# EAGLE schematic Bidirectional_Amp (EAGLE 8.6.1)

## Sheet 1 of 7: WiFi Adapter Interface and TX/RX Control
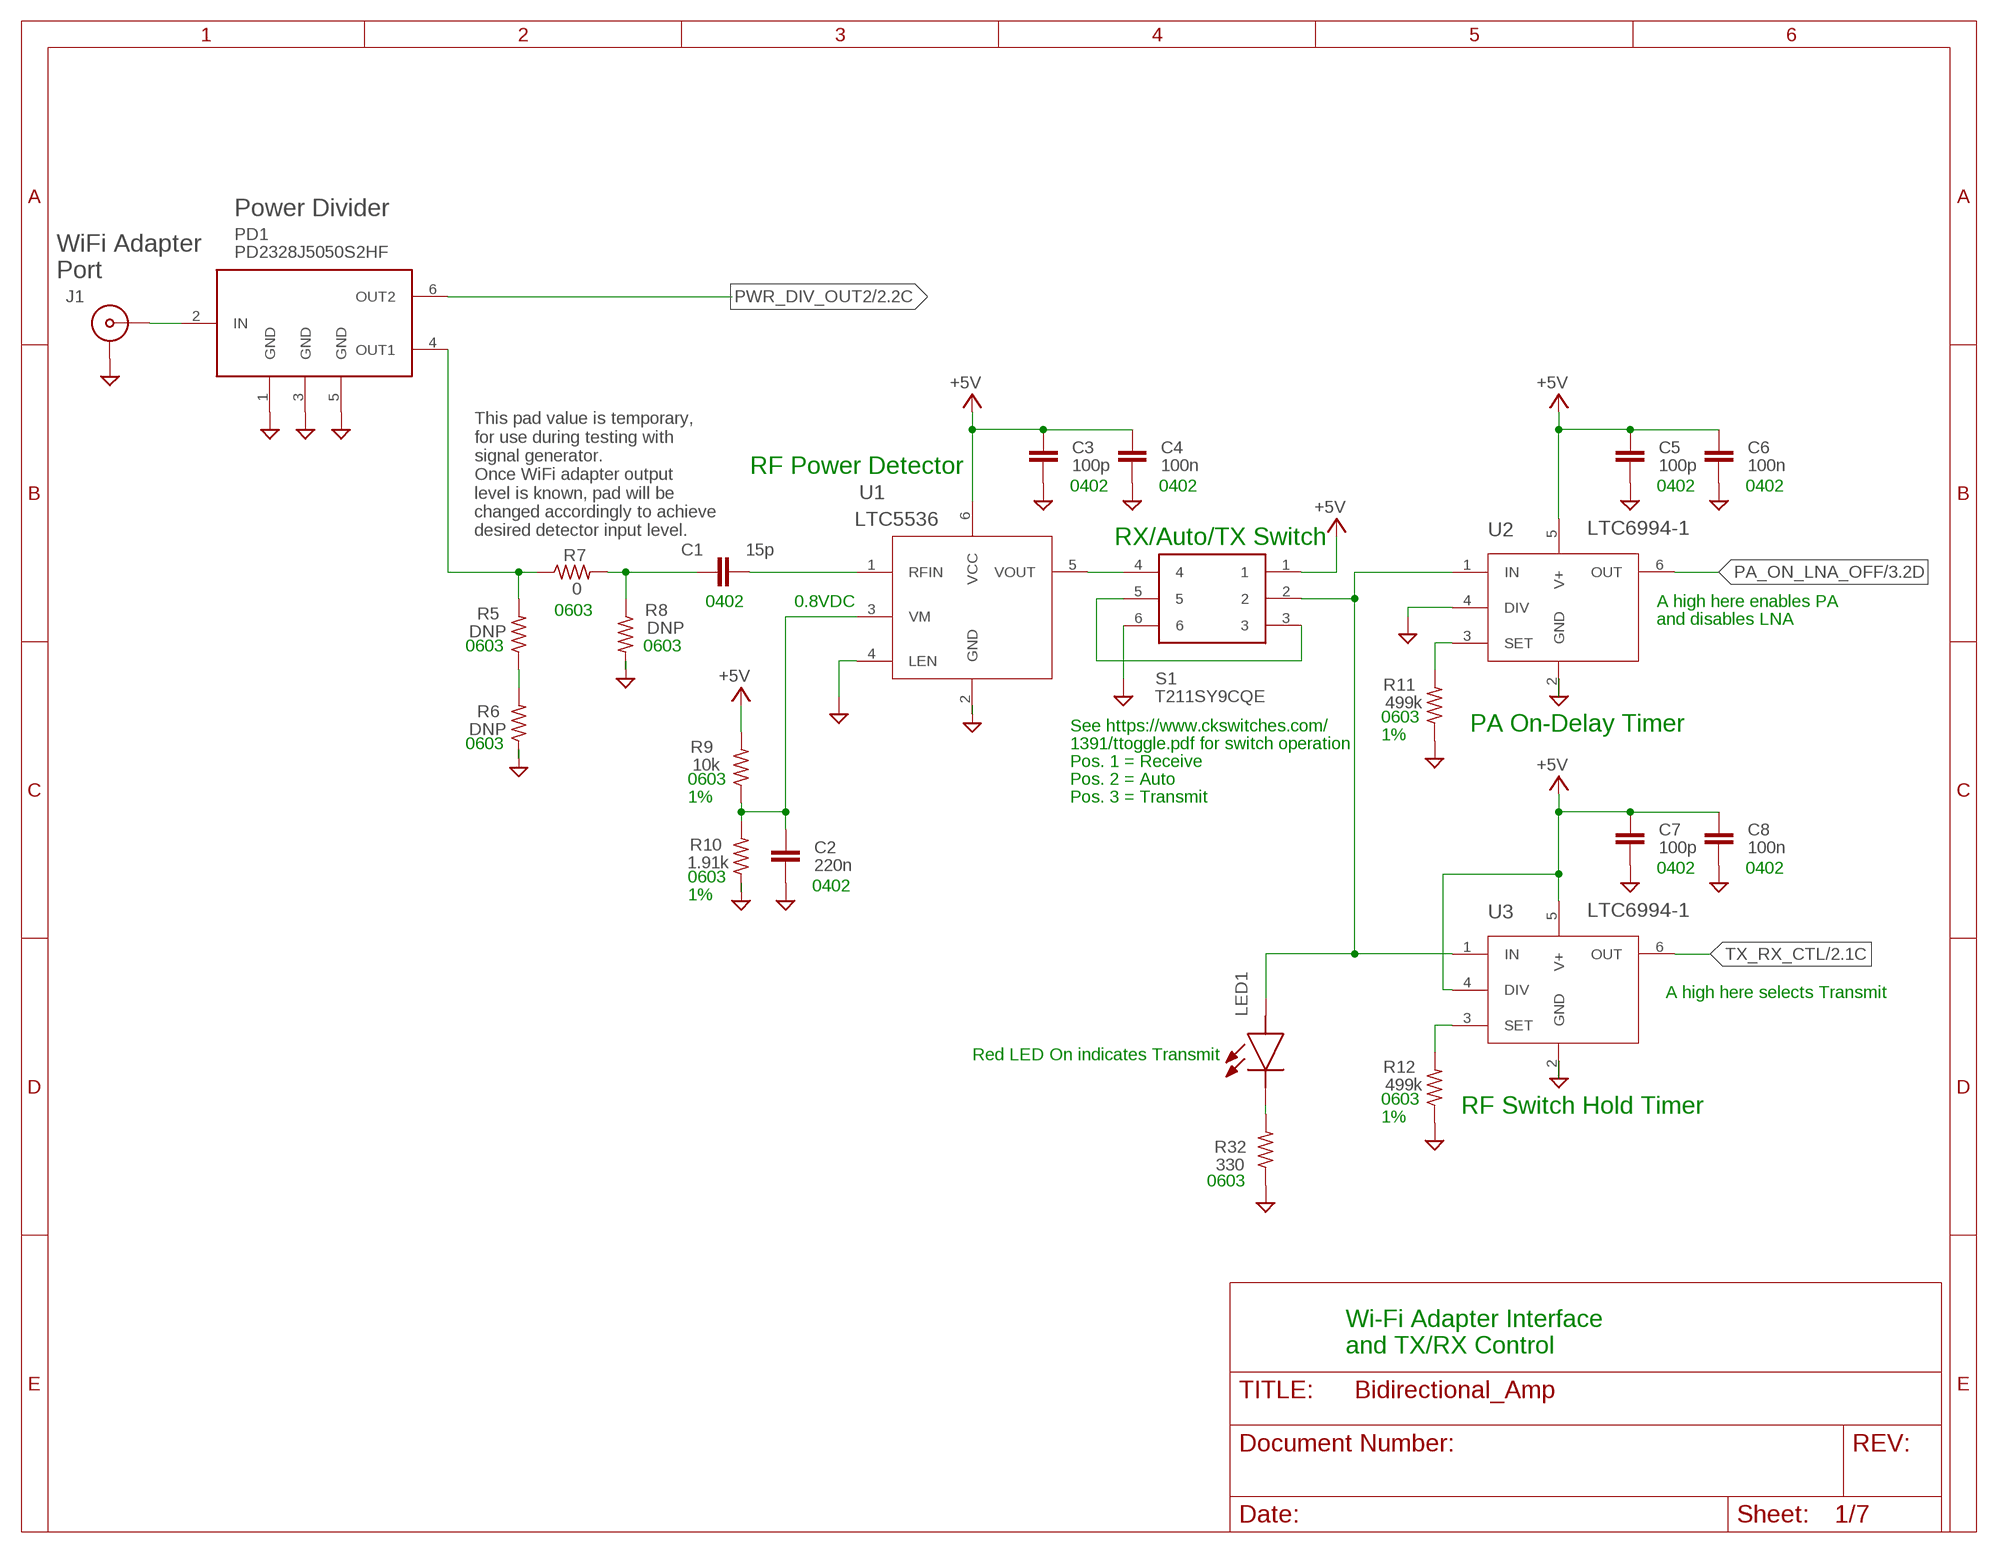
[diagram p0: schematic, sheet 1]

### Parts
C1  15p  C-EUC0402  [C0402]
C2  220n  C-EUC0402  [C0402]
C3  100p  C-EUC0402  [C0402]
C4  100n  C-EUC0402  [C0402]
C5  100p  C-EUC0402  [C0402]
C6  100n  C-EUC0402  [C0402]
C7  100p  C-EUC0402  [C0402]
C8  100n  C-EUC0402  [C0402]
J1  73415-2061  [73415-2063]
LED1  VLMK3102-GS08  [PLCC-2]
PD1  PD2328J5050S2HF  [PSON65P204X129X58-6N]
R5  DNP  R-US_R0603  [R0603]
R6  DNP  R-US_R0603  [R0603]
R7  0  R-US_R0603  [R0603]
R8  DNP  R-US_R0603  [R0603]
R9  10k  R-US_R0603  [R0603]
R10  1.91k  R-US_R0603  [R0603]
R11  499k  R-US_R0603  [R0603]
R12  499k  R-US_R0603  [R0603]
R32  330  R-US_R0603  [R0603]
S1  T211SY9CQE  T201MH9V3BE  [T201MH9V3BE]
U1  LTC5536  LTC5536ES6TRMPBF  [TSOT-23_S6]
U2  LTC6994-1  LTC6994CS6-1PBF  [TSOT-23_S6]
U3  LTC6994-1  LTC6994CS6-1PBF  [TSOT-23_S6]

### Nets
+5V: C3.1 C4.1 C5.1 C6.1 C7.1 C8.1 R9.2 S1.1 U1.6(VCC) U2.5(V+) U3.4(DIV) U3.5(V+) ; also sheet 2,3,4,5,6
GND: C2.2 C3.2 C4.2 C5.2 C6.2 C7.2 C8.2 J1.2(GND) J1.3(GND) J1.4(GND) J1.5(GND) PD1.1(GND) PD1.3(GND) PD1.5(GND) R6.1 R8.2 R10.1 R11.1 R12.1 R32.1 S1.6 U1.2(GND) U1.4(LEN) U2.2(GND) U2.4(DIV) U3.2(GND) ; also sheet 2,3,4,5,6,7
N$1 [RF]: J1.1(CTR) PD1.2(IN)
N$3: S1.4 U1.5(VOUT)
N$5 [RF]: PD1.4(OUT1) R5.2 R7.1
N$6 [RF]: C1.1 R7.2 R8.1
N$7: R5.1 R6.2
N$8 [RF]: C1.2 U1.1(RFIN)
N$9: C2.1 R9.1 R10.2 U1.3(VM)
N$10: LED1.2(A) S1.2 U2.1(IN) U3.1(IN)
N$11: R11.2 U2.3(SET)
N$12: S1.3 S1.5
N$14: R12.2 U3.3(SET)
N$15: LED1.1(K) R32.2
PA_ON_LNA_OFF: U2.6(OUT) ; also sheet 3,4
PWR_DIV_OUT2 [RF]: PD1.6(OUT2) ; also sheet 2
TX_RX_CTL: U3.6(OUT) ; also sheet 2,5

### Notes on the sheet
- Power Divider
- WiFi Adapter
  Port
- RF Power Detector
- 0402 | 0402 | 0402 | 0402
- This pad value is temporary,
  for use during testing with
  signal generator.
  Once WiFi adapter output
  level is known, pad will be
  changed accordingly to achieve
  desired detector input level.
- RX/Auto/TX Switch
- 0402 | 0.8VDC | A high here enables PA
- 0603
- and disables LNA
- 0603 | 0603
- 0603
- See https://www.ckswitches.com/ | PA On-Delay Timer
- 1%
- 0603 | 1391/ttoggle.pdf for switch operation
- Pos. 1 = Receive
- 0603 | Pos. 2 = Auto
- 1% | Pos. 3 = Transmit
- 0402 | 0402
- 0603
- 0402
- 1%
- A high here selects Transmit
- Red LED On indicates Transmit
- 0603
- RF Switch Hold Timer
- 1%
- 0603
- Wi-Fi Adapter Interface
  and TX/RX Control

## Sheet 2 of 7: TX/RX Switching, WiFi Adapter Side
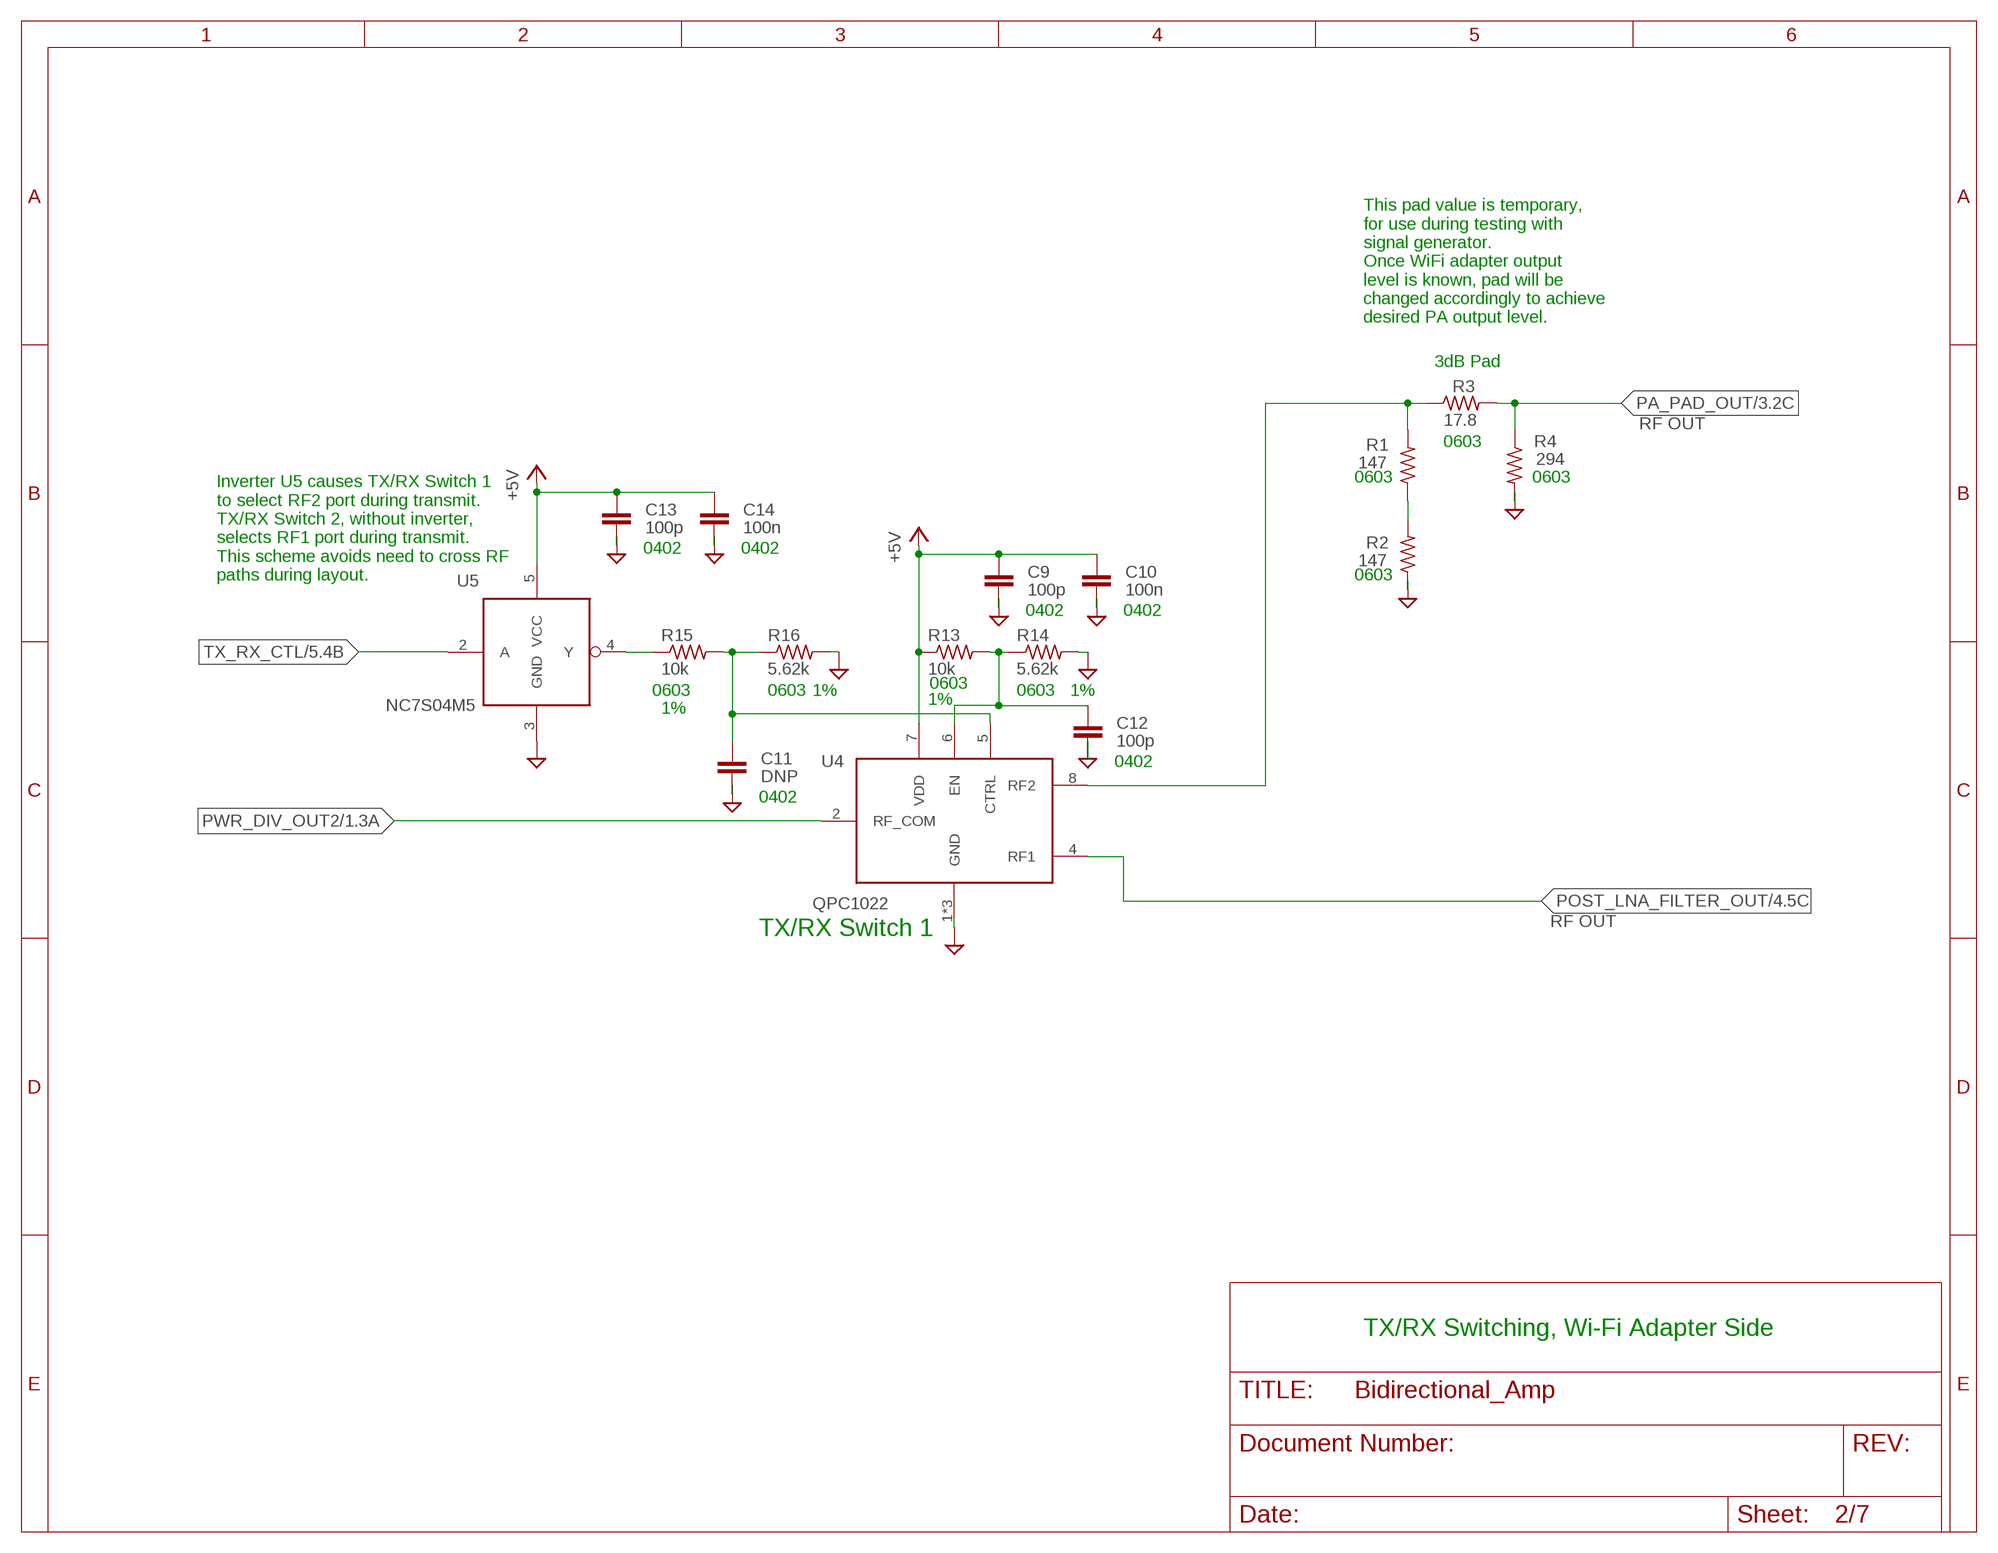
[diagram p1: schematic, sheet 2]

### Parts
C9  100p  C-EUC0402  [C0402]
C10  100n  C-EUC0402  [C0402]
C11  DNP  C-EUC0402  [C0402]
C12  100p  C-EUC0402  [C0402]
C13  100p  C-EUC0402  [C0402]
C14  100n  C-EUC0402  [C0402]
R1  147  R-US_R0603  [R0603]
R2  147  R-US_R0603  [R0603]
R3  17.8  R-US_R0603  [R0603]
R4  294  R-US_R0603  [R0603]
R13  10k  R-US_0603-B-NOSILK  [.0603-B-NOSILK]
R14  5.62k  R-US_0603-B-NOSILK  [.0603-B-NOSILK]
R15  10k  R-US_0603-B-NOSILK  [.0603-B-NOSILK]
R16  5.62k  R-US_0603-B-NOSILK  [.0603-B-NOSILK]
U4  QPC1022  [QPC1022]
U5  NC7S04M5  NC7S04M5XX  [SOT95P280X140-5N]

### Nets
+5V: C9.1 C10.1 C13.1 C14.1 R13.1 U4.7(VDD) U5.5(VCC) ; also sheet 1,3,4,5,6
GND: C9.2 C10.2 C11.2 C12.2 C13.2 C14.2 R2.1 R4.2 R14.2 R16.2 U4.1(GND) U4.3(GND) U4.9(GND) U5.3(GND) ; also sheet 1,3,4,5,6,7
N$2 [RF]: R1.2 R3.1 U4.8(RF2)
N$4: R1.1 R2.2
N$13: C12.1 R13.2 R14.1 U4.6(EN)
N$17: C11.1 R15.2 R16.1 U4.5(CTRL)
N$18: R15.1 U5.4(Y)
PA_PAD_OUT [RF]: R3.2 R4.1 ; also sheet 3
POST_LNA_FILTER_OUT [RF]: U4.4(RF1) ; also sheet 4
PWR_DIV_OUT2 [RF]: U4.2(RF_COM) ; also sheet 1
TX_RX_CTL: U5.2(A) ; also sheet 1,5

### Notes on the sheet
- This pad value is temporary,
  for use during testing with
  signal generator.
  Once WiFi adapter output
  level is known, pad will be
  changed accordingly to achieve
  desired PA output level.
- 3dB Pad
- RF OUT
- 0603
- 0603 | 0603
- 0402 | 0402
- Inverter U5 causes TX/RX Switch 1
  to select RF2 port during transmit.
  TX/RX Switch 2, without inverter,
  selects RF1 port during transmit.
  This scheme avoids need to cross RF
  paths during layout.
- 0603
- 0402 | 0402
- 0603
- 0603 | 0603 | 1% | 0603 | 1%
- 1%
- 1%
- 0402
- 0402
- RF OUT
- TX/RX Switch 1
- TX/RX Switching, Wi-Fi Adapter Side

## Sheet 3 of 7: Power Amplifier
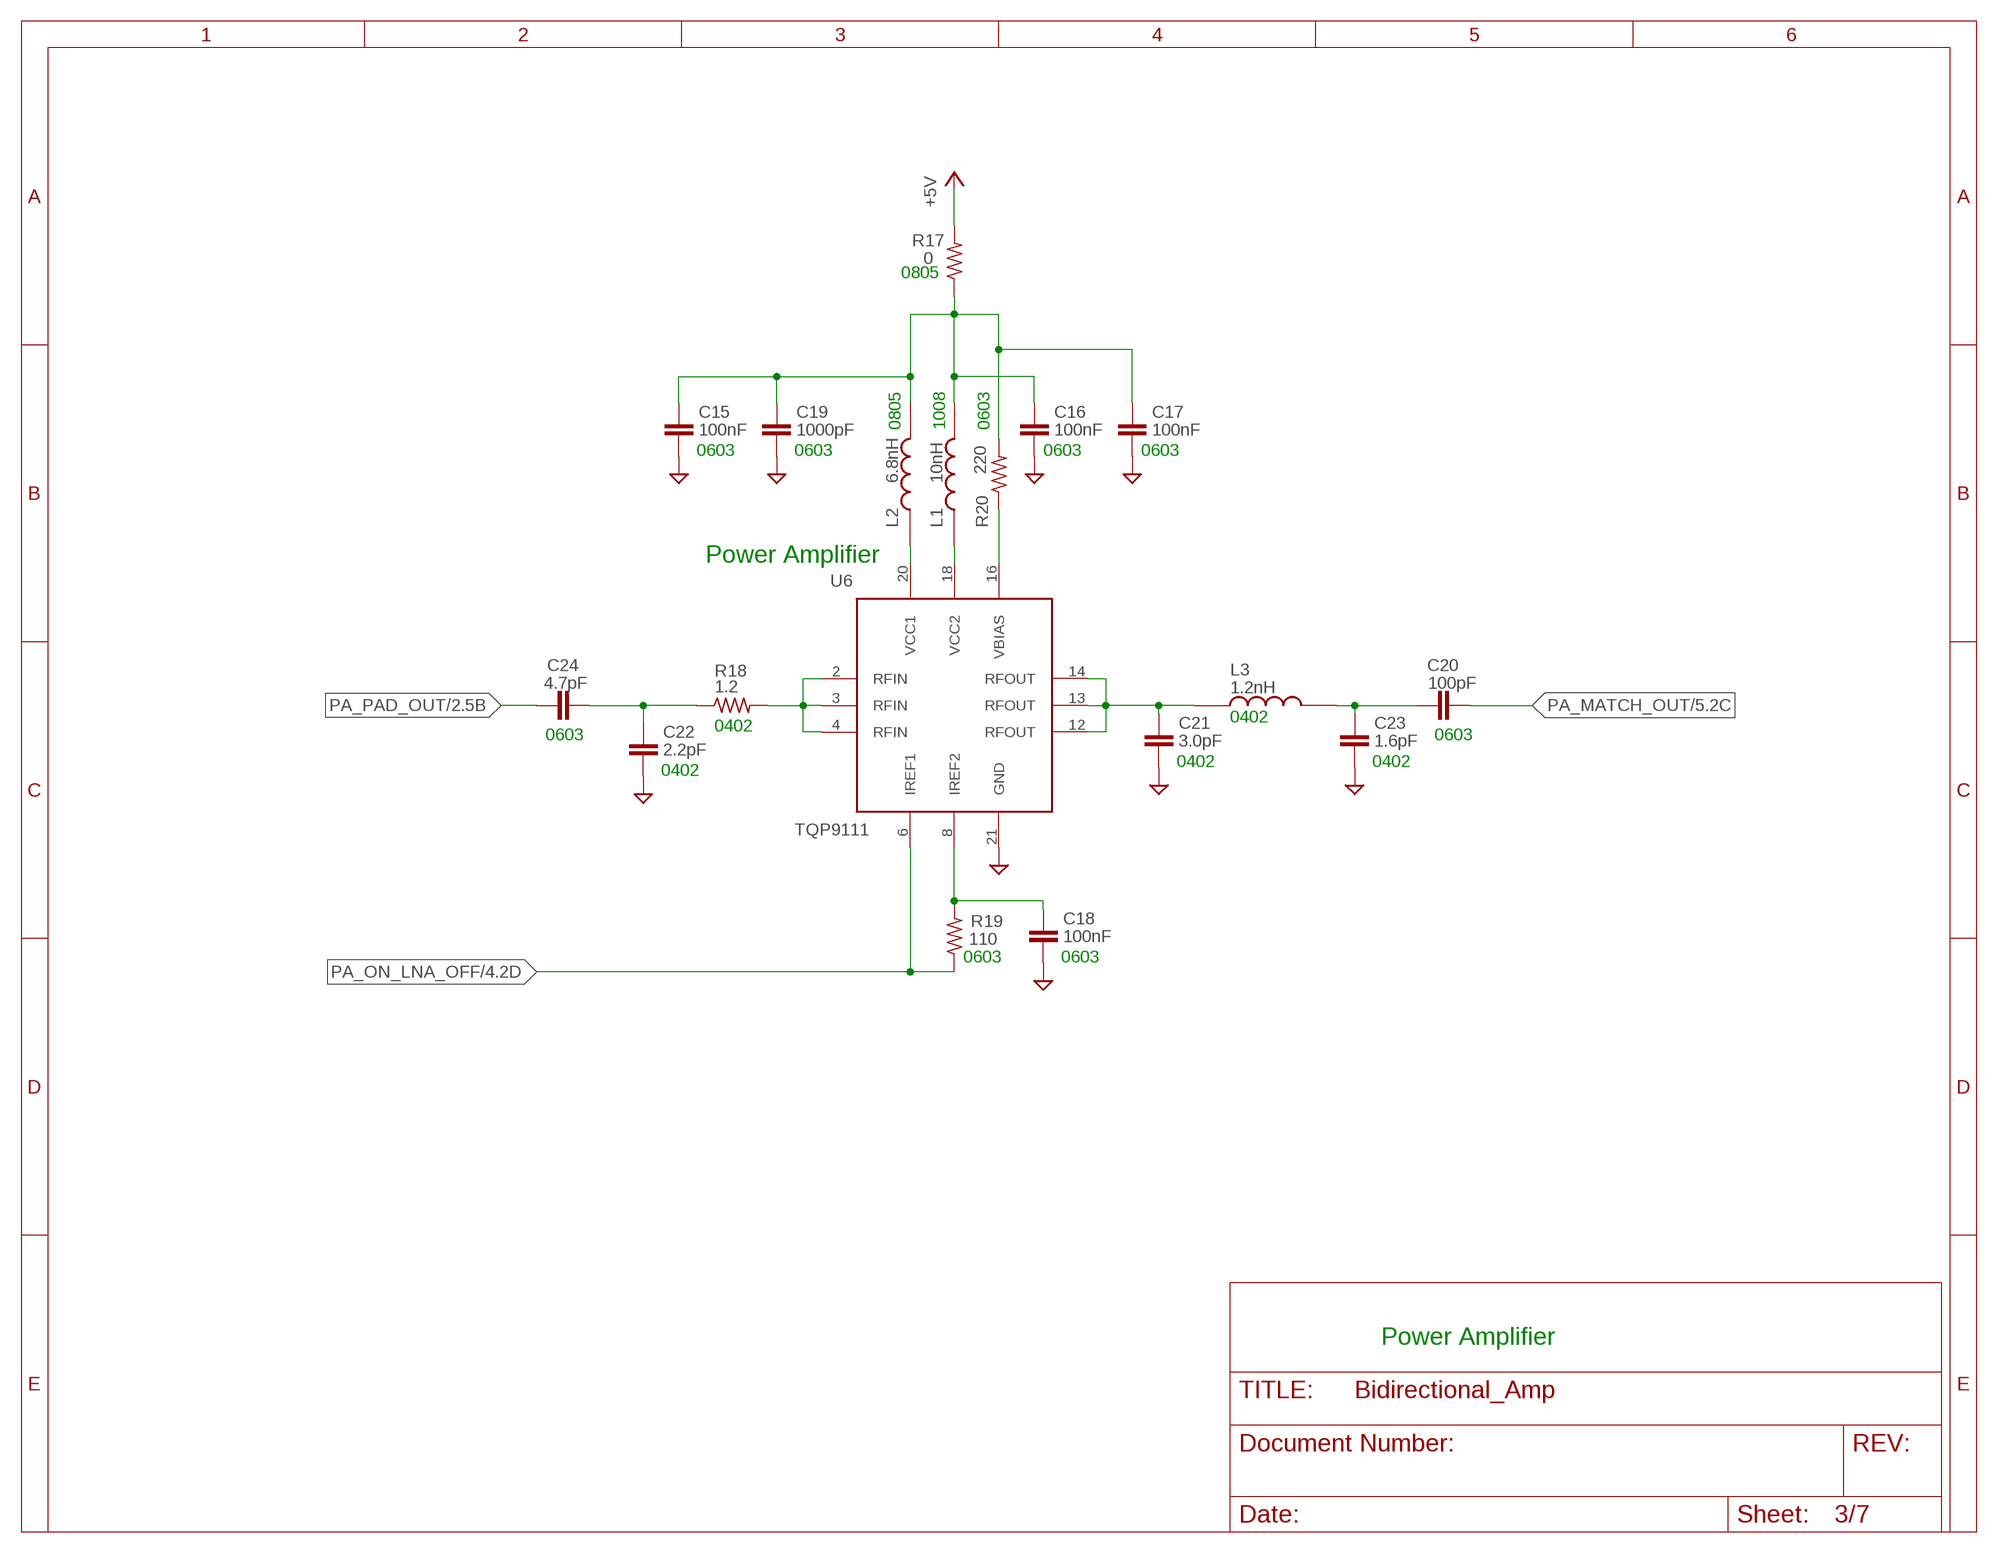
[diagram p2: schematic, sheet 3]

### Parts
C15  100nF  C-EUC0603  [C0603]
C16  100nF  C-EUC0603  [C0603]
C17  100nF  C-EUC0603  [C0603]
C18  100nF  C-EUC0603  [C0603]
C19  1000pF  C-EUC0603  [C0603]
C20  100pF  C-EUC0603  [C0603]
C21  3.0pF  C-EUC0402  [C0402]
C22  2.2pF  C-EUC0402  [C0402]
C23  1.6pF  C-EUC0402  [C0402]
C24  4.7pF  C-EUC0603  [C0603]
L1  10nH  1008HQ-10NXJLB  [INDC2928X203N]
L2  6.8nH  0805CS-060XJLC  [0805CS]
L3  1.2nH  0402CS-1N2XJLW  [0402CS1N2XJLW]
R17  0  R-US_R0805  [R0805]
R18  1.2  R-US_R0402  [R0402]
R19  110  R-US_R0603  [R0603]
R20  220  R-US_R0603  [R0603]
U6  TQP9111  [QFN50P400X400X102-21N]

### Nets
+5V: R17.2 ; also sheet 1,2,4,5,6
GND: C15.2 C16.2 C17.2 C18.2 C19.2 C21.2 C22.2 C23.2 U6.21(GND) ; also sheet 1,2,4,5,6,7
N$16: L2.1 U6.20(VCC1)
N$19: L1.1 U6.18(VCC2)
N$20: R20.1 U6.16(VBIAS)
N$21: C15.1 C16.1 C17.1 C19.1 L1.2 L2.2 R17.1 R20.2
N$22: C18.1 R19.2 U6.8(IREF2)
N$23 [RF]: R18.2 U6.2(RFIN) U6.3(RFIN) U6.4(RFIN)
N$24 [RF]: C21.1 L3.1 U6.12(RFOUT) U6.13(RFOUT) U6.14(RFOUT)
N$25 [RF]: C22.1 C24.2 R18.1
N$27 [RF]: C20.1 C23.1 L3.2
PA_MATCH_OUT [RF]: C20.2 ; also sheet 5
PA_ON_LNA_OFF: R19.1 U6.6(IREF1) ; also sheet 1,4
PA_PAD_OUT [RF]: C24.1 ; also sheet 2

### Notes on the sheet
- 0805
- 0805 | 1008 | 0603
- 0603 | 0603 | 0603 | 0603
- Power Amplifier
- 0402
- 0402
- 0603 | 0603
- 0402 | 0402
- 0402
- 0603 | 0603
- Power Amplifier

## Sheet 4 of 7: LNA and RX Bandpass Filters
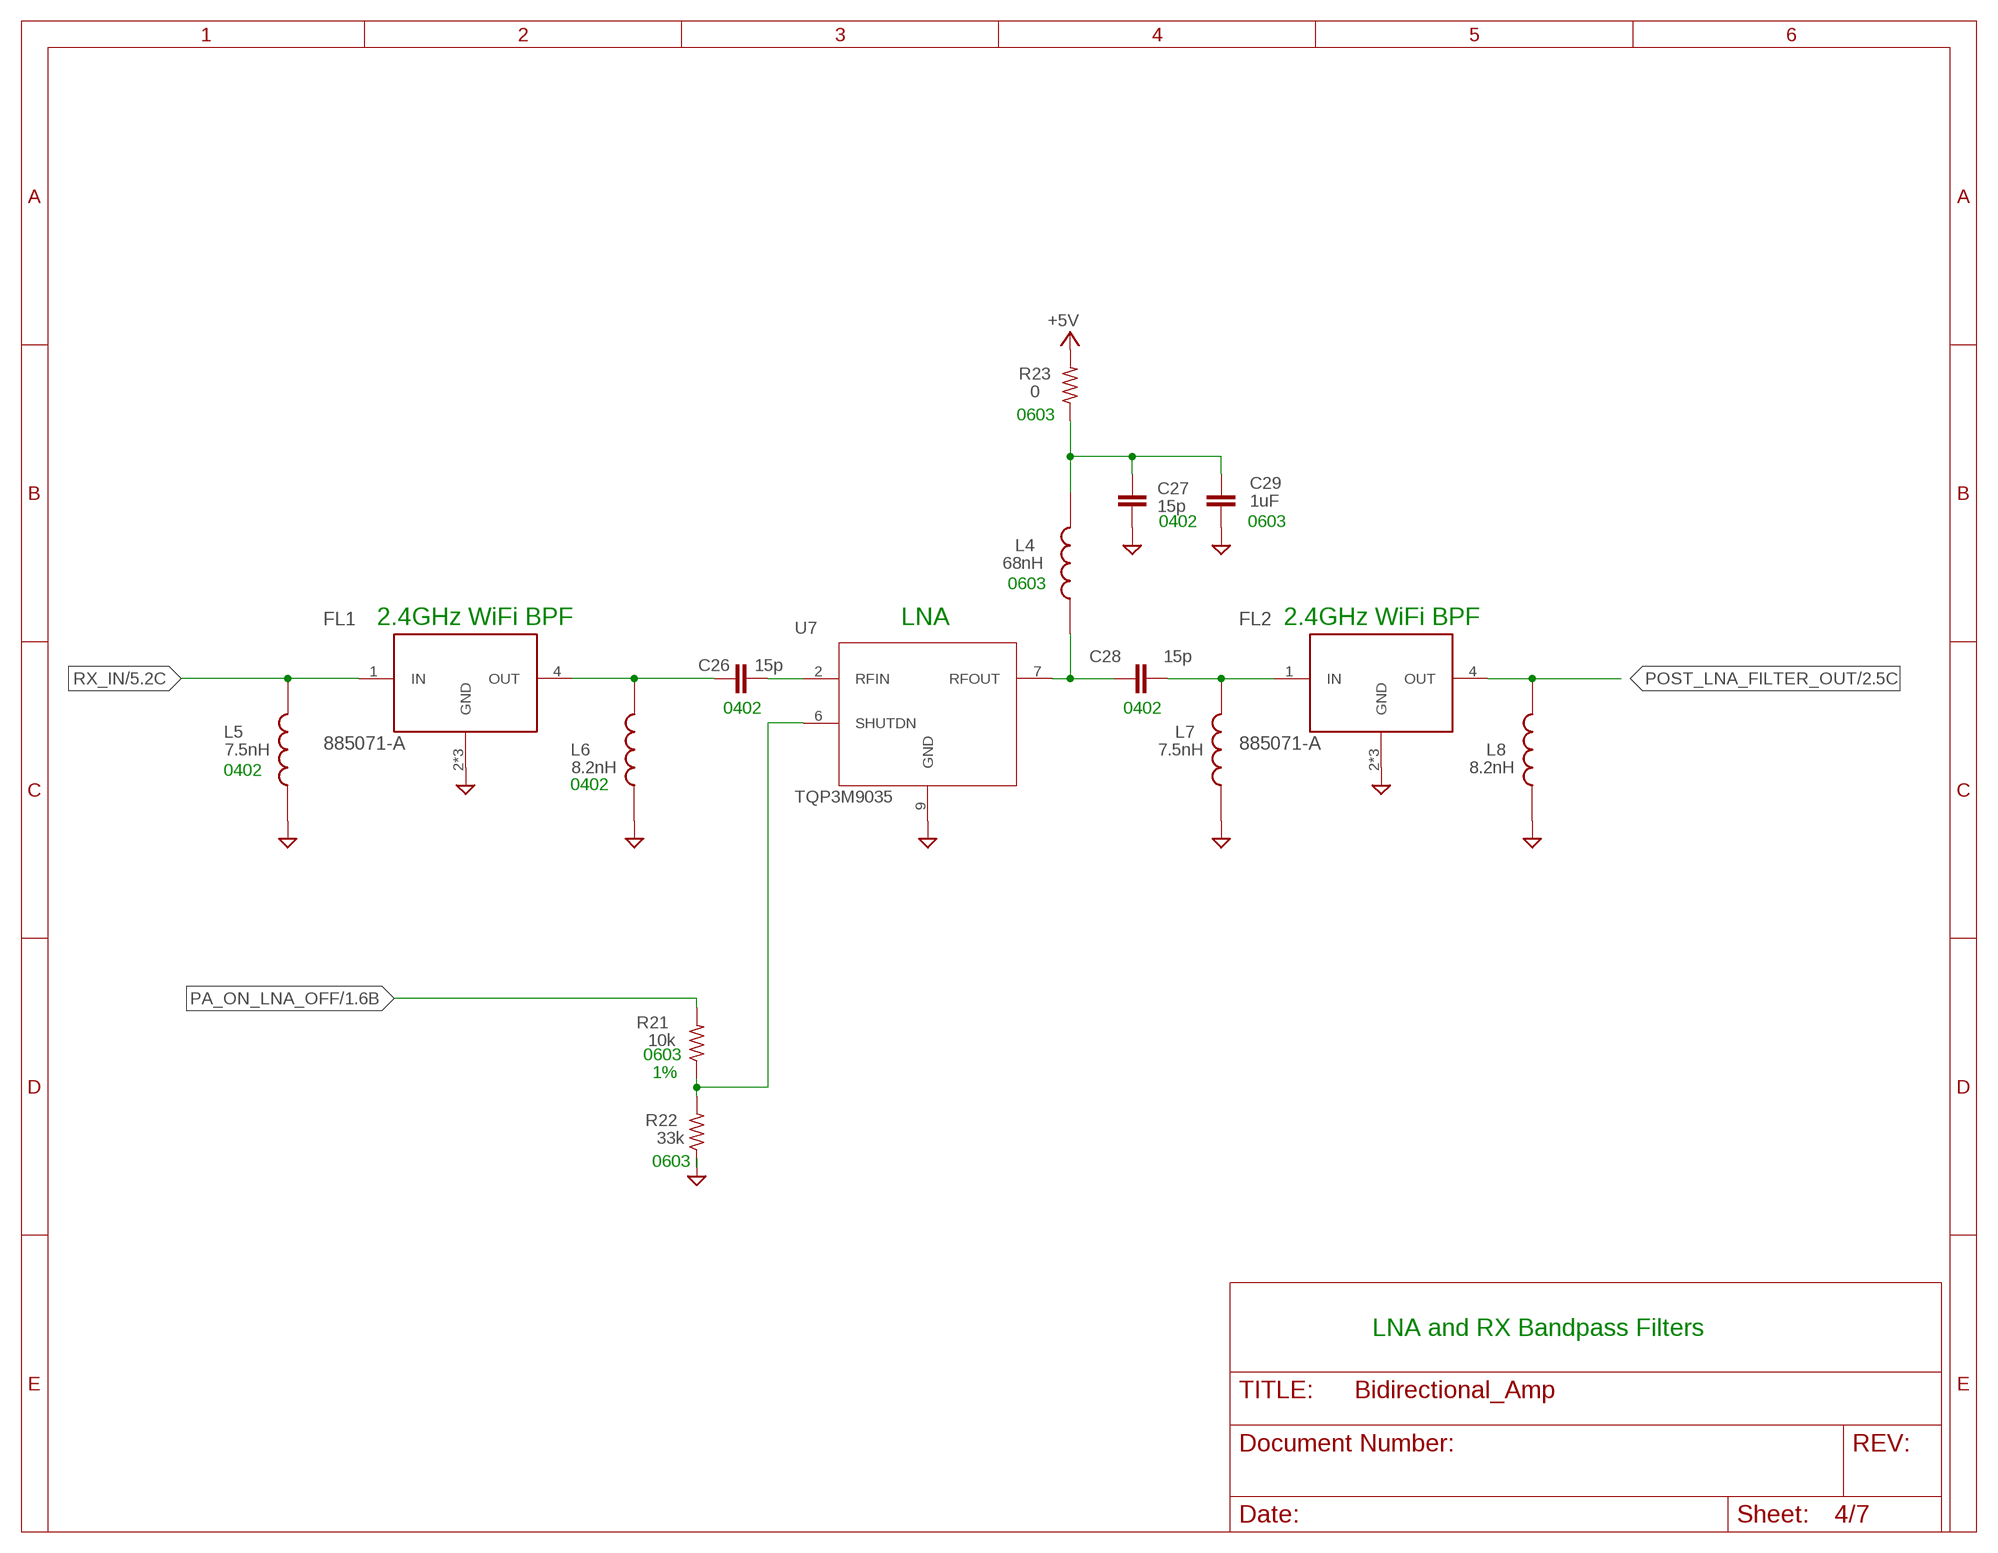
[diagram p3: schematic, sheet 4]

### Parts
C26  15p  C-EUC0402  [C0402]
C27  15p  C-EUC0402  [C0402]
C28  15p  C-EUC0402  [C0402]
C29  1uF  C-EUC0603  [C0603]
FL1  885071-A  [FIL_B39162B9417K610]
FL2  885071-A  [FIL_B39162B9417K610]
L4  68nH  0603CS-68NXJLW  [0603CS-68NXJLW]
L5  7.5nH  0402CS-1N2XJLW  [0402CS1N2XJLW]
L6  8.2nH  0402CS-1N2XJLW  [0402CS1N2XJLW]
L7  7.5nH  0402CS-1N2XJLW  [0402CS1N2XJLW]
L8  8.2nH  0402CS-1N2XJLW  [0402CS1N2XJLW]
R21  10k  R-US_R0603  [R0603]
R22  33k  R-US_R0603  [R0603]
R23  0  R-US_R0603  [R0603]
U7  TQP3M9035  [DFN-8]

### Nets
+5V: R23.2 ; also sheet 1,2,3,5,6
GND: C27.1 C29.2 FL1.2(GND) FL1.3(GND) FL1.5(GND) FL2.2(GND) FL2.3(GND) FL2.5(GND) L5.1 L6.1 L7.1 L8.1 R22.1 U7.9(GND) ; also sheet 1,2,3,5,6,7
N$26 [RF]: C26.2 U7.2(RFIN)
N$28 [RF]: C28.1 L4.1 U7.7(RFOUT)
N$29: C27.2 C29.1 L4.2 R23.1
N$30: R21.1 R22.2 U7.6(SHUTDN)
N$33 [RF]: C26.1 FL1.4(OUT) L6.2
N$35 [RF]: C28.2 FL2.1(IN) L7.2
PA_ON_LNA_OFF: R21.2 ; also sheet 1,3
POST_LNA_FILTER_OUT [RF]: FL2.4(OUT) L8.2 ; also sheet 2
RX_IN [RF]: FL1.1(IN) L5.2 ; also sheet 5

### Notes on the sheet
- 0603
- 0402 | 0603
- 0603
- 2.4GHz WiFi BPF | LNA | 2.4GHz WiFi BPF
- 0402 | 0402
- 0402
- 0402
- 0603
- 1%
- 0603
- LNA and RX Bandpass Filters

## Sheet 5 of 7: TX/RX Switching, Antenna Side
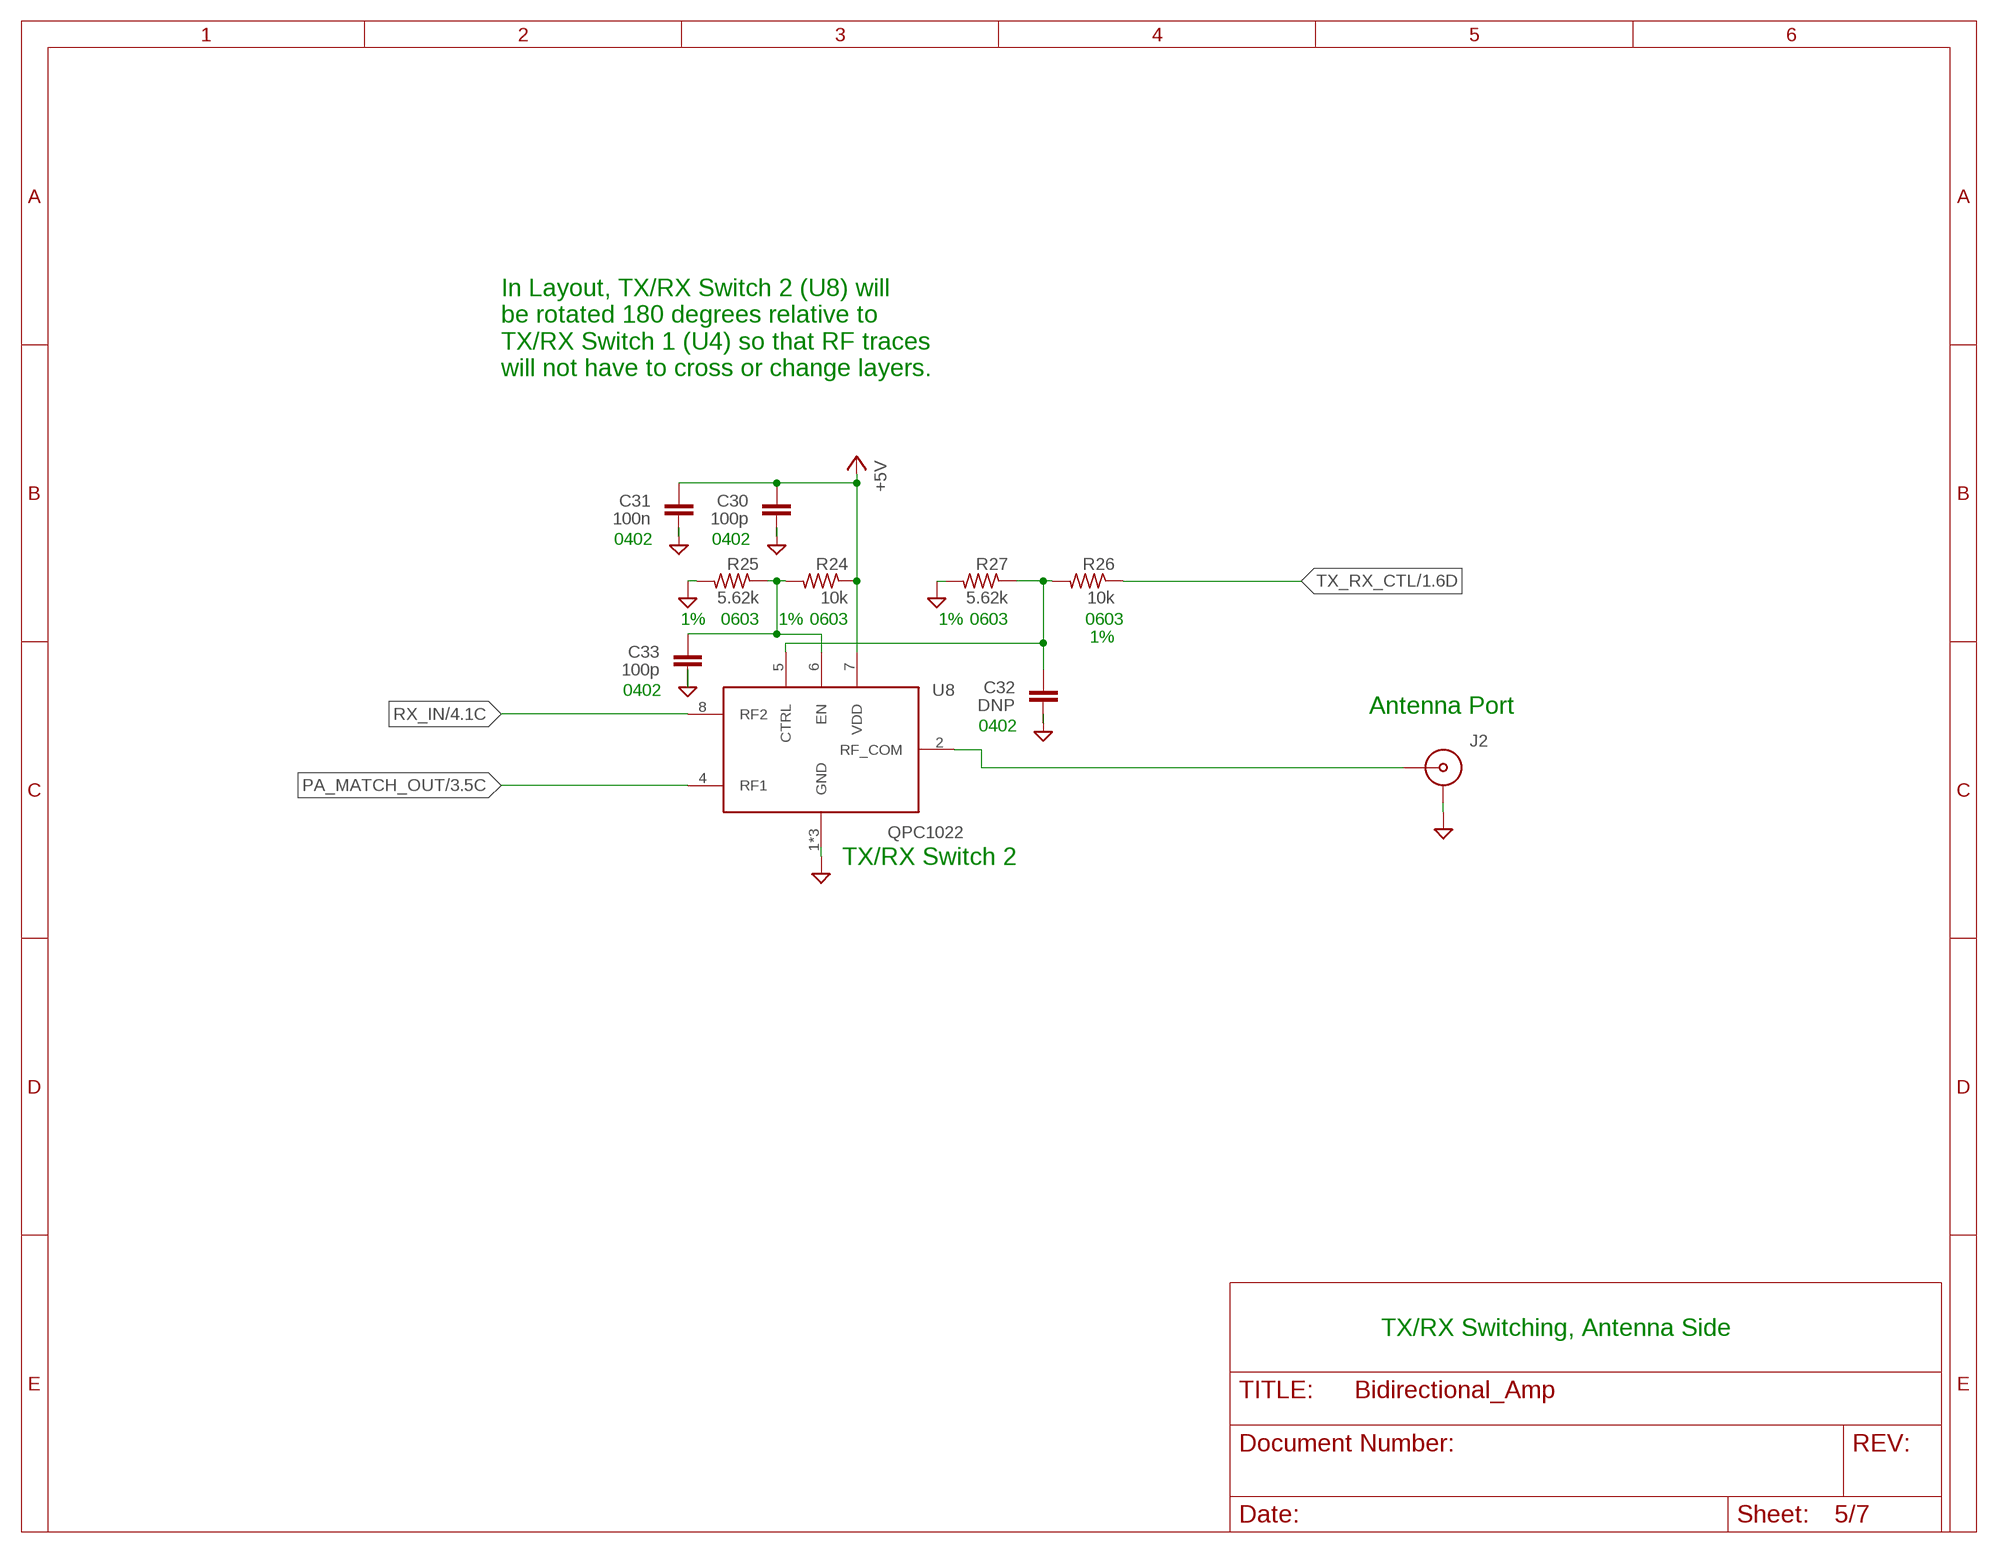
[diagram p4: schematic, sheet 5]

### Parts
C30  100p  C-EUC0402  [C0402]
C31  100n  C-EUC0402  [C0402]
C32  DNP  C-EUC0402  [C0402]
C33  100p  C-EUC0402  [C0402]
J2  73415-2061  [73415-2063]
R24  10k  R-US_0603-B-NOSILK  [.0603-B-NOSILK]
R25  5.62k  R-US_0603-B-NOSILK  [.0603-B-NOSILK]
R26  10k  R-US_0603-B-NOSILK  [.0603-B-NOSILK]
R27  5.62k  R-US_0603-B-NOSILK  [.0603-B-NOSILK]
U8  QPC1022  [QPC1022]

### Nets
+5V: C30.1 C31.1 R24.1 U8.7(VDD) ; also sheet 1,2,3,4,6
GND: C30.2 C31.2 C32.2 C33.2 J2.2(GND) J2.3(GND) J2.4(GND) J2.5(GND) R25.2 R27.2 U8.1(GND) U8.3(GND) U8.9(GND) ; also sheet 1,2,3,4,6,7
N$31 [RF]: J2.1(CTR) U8.2(RF_COM)
N$32: C33.1 R24.2 R25.1 U8.6(EN)
N$34: C32.1 R26.2 R27.1 U8.5(CTRL)
PA_MATCH_OUT [RF]: U8.4(RF1) ; also sheet 3
RX_IN [RF]: U8.8(RF2) ; also sheet 4
TX_RX_CTL: R26.1 ; also sheet 1,2

### Notes on the sheet
- In Layout, TX/RX Switch 2 (U8) will
  be rotated 180 degrees relative to
  TX/RX Switch 1 (U4) so that RF traces
  will not have to cross or change layers.
- 0402 | 0402
- 1% | 0603 | 1% | 0603 | 1% | 0603 | 0603
- 1%
- 0402
- Antenna Port
- 0402
- TX/RX Switch 2
- TX/RX Switching, Antenna Side

## Sheet 6 of 7: +5V Step-Up DC/DC Converter
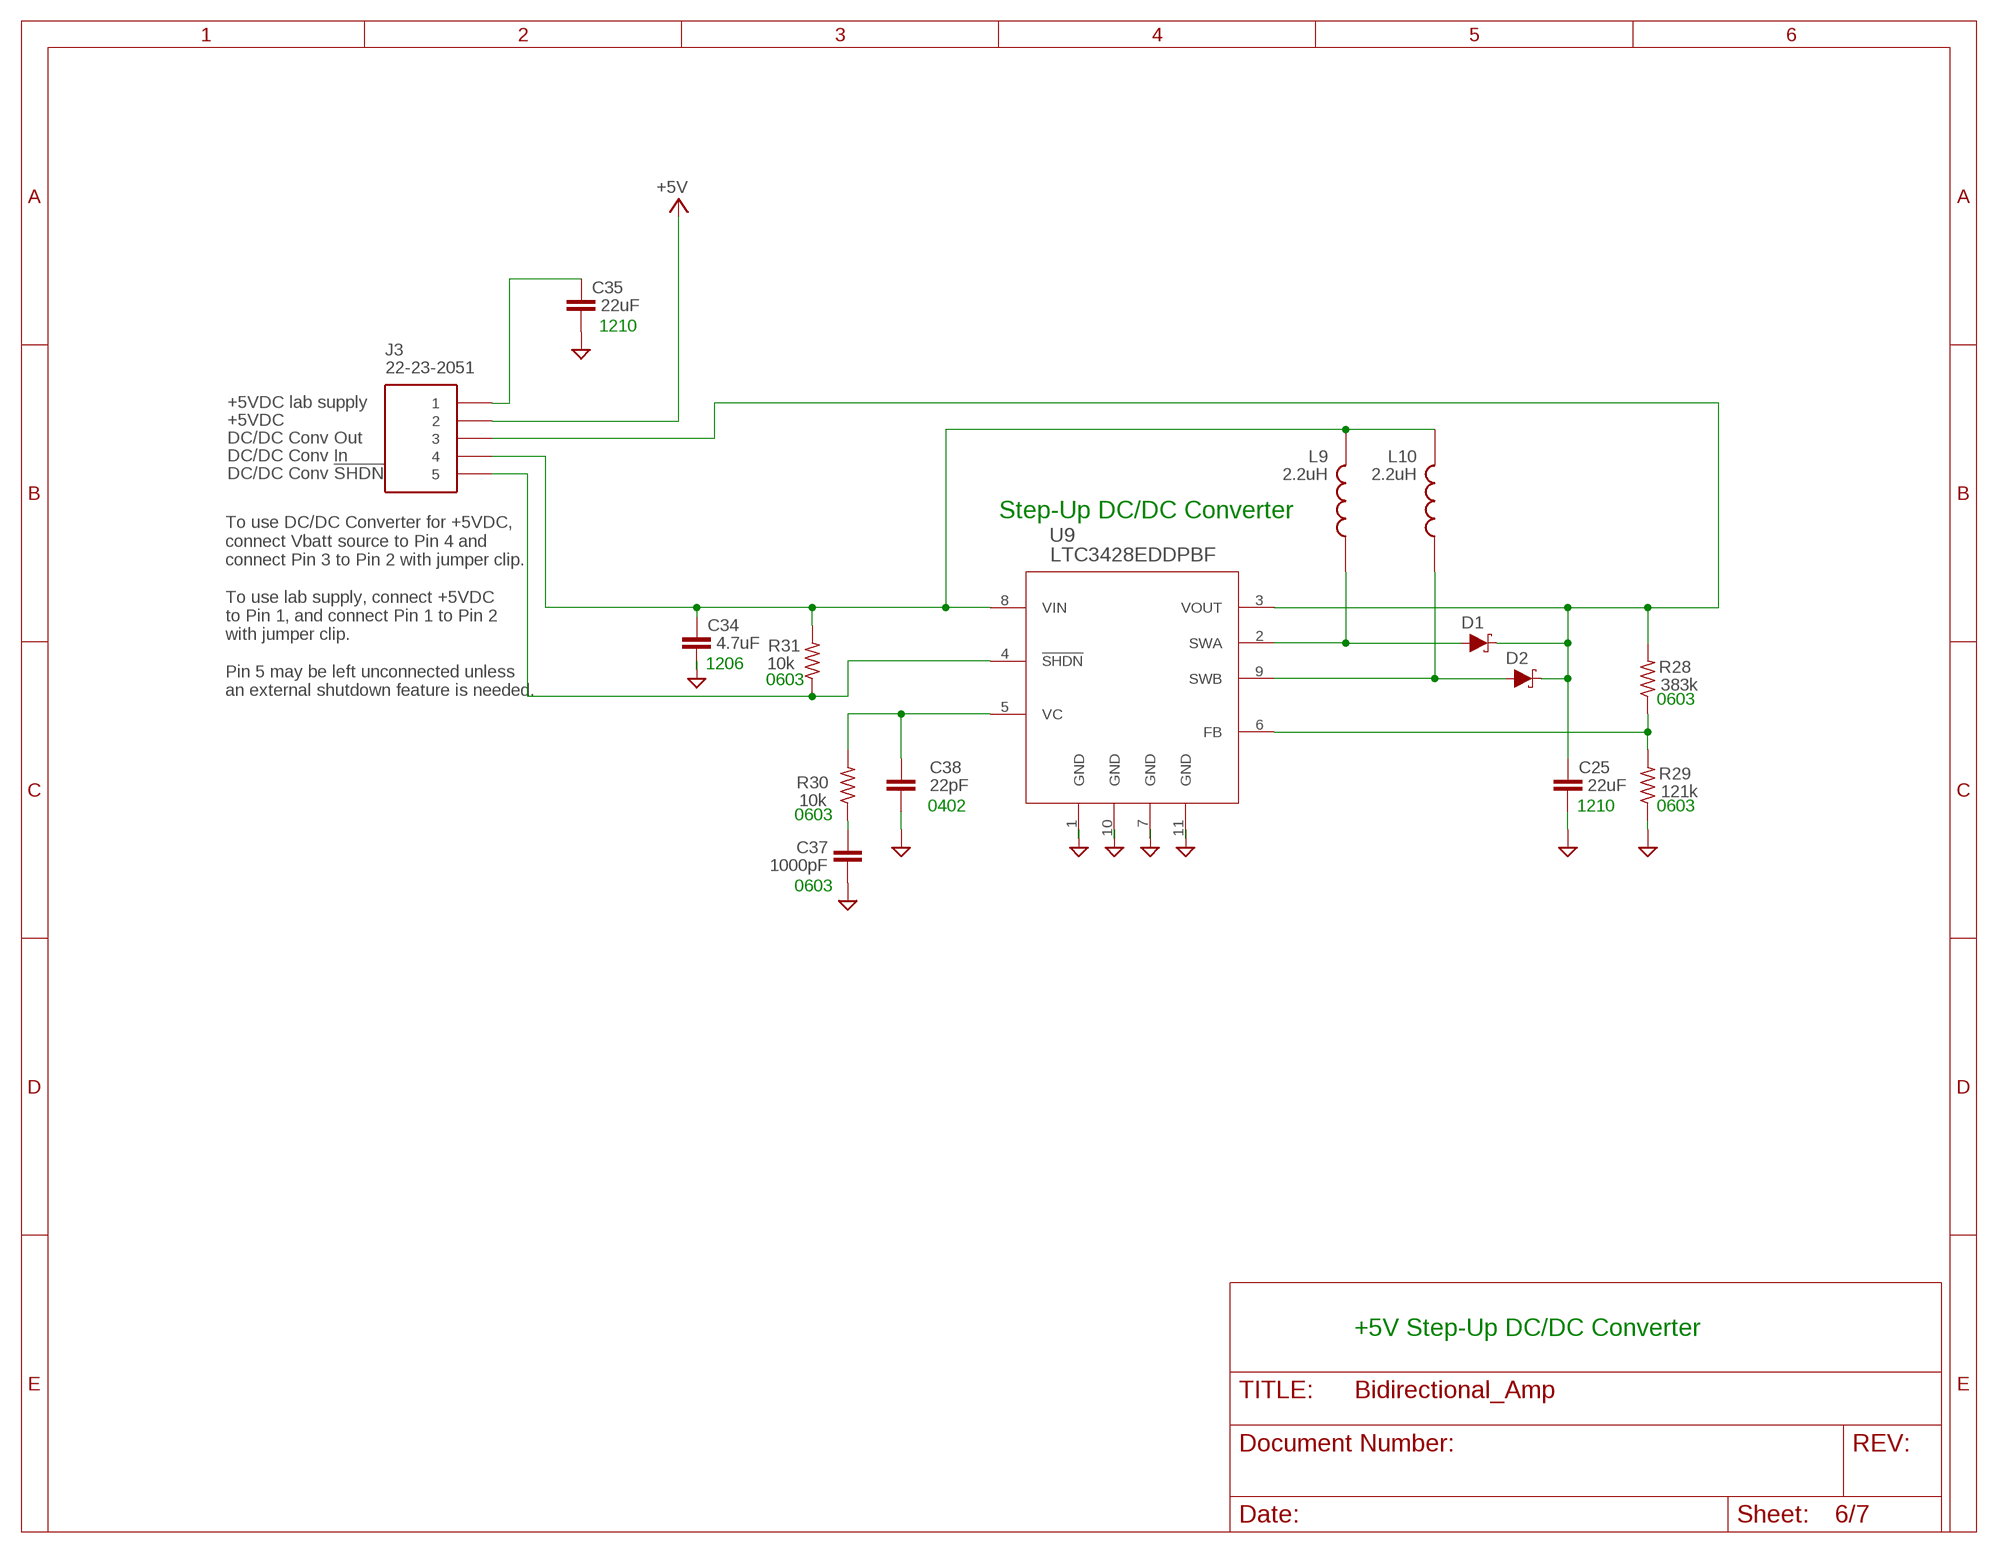
[diagram p5: schematic, sheet 6]

### Parts
C25  22uF  C-EUC1210  [C1210]
C34  4.7uF  C-EUC1206  [C1206]
C35  22uF  C-EUC1210  [C1210]
C37  1000pF  C-EUC0603  [C0603]
C38  22pF  C-EUC0402  [C0402]
D1  DIODE-SCHOTTKY-PMEG4005EJ  [SOD-323]
D2  DIODE-SCHOTTKY-PMEG4005EJ  [SOD-323]
J3  22-23-2051  [HDRV5W107P0X254_1X5_1255X635X8]
L9  2.2uH  XFL4020-222MEB  [XFL4020-222ME]
L10  2.2uH  XFL4020-222MEB  [XFL4020-222ME]
R28  383k  R-US_0603-B-NOSILK  [.0603-B-NOSILK]
R29  121k  R-US_0603-B-NOSILK  [.0603-B-NOSILK]
R30  10k  R-US_0603-B-NOSILK  [.0603-B-NOSILK]
R31  10k  R-US_0603-B-NOSILK  [.0603-B-NOSILK]
U9  LTC3428EDDPBF  [DFN-10_DD]

### Nets
+5V: J3.2 ; also sheet 1,2,3,4,5
GND: C25.2 C34.2 C35.2 C37.2 C38.2 R29.1 U9.1(GND) U9.7(GND) U9.10(GND) U9.11(GND) ; also sheet 1,2,3,4,5,7
N$36: D1.A L9.1 U9.2(SWA)
N$37: D2.A L10.1 U9.9(SWB)
N$38: C25.1 D1.C D2.C J3.3 R28.2 U9.3(VOUT)
N$39: R28.1 R29.2 U9.6(FB)
N$40: C37.1 R30.1
N$42: J3.5 R31.1 U9.4(!SHDN)
N$43: C38.1 R30.2 U9.5(VC)
N$44: C34.1 J3.4 L9.2 L10.2 R31.2 U9.8(VIN)
N$45: C35.1 J3.1

### Notes on the sheet
- 1210
- +5VDC lab supply
- +5VDC
- DC/DC Conv Out
- DC/DC Conv In
- DC/DC Conv !SHDN!
- Step-Up DC/DC Converter
- 1206
- 0603
- To use DC/DC Converter for +5VDC,
  connect Vbatt source to Pin 4 and
  connect Pin 3 to Pin 2 with jumper clip.
  
  To use lab supply, connect +5VDC
  to Pin 1, and connect Pin 1 to Pin 2
  with jumper clip.
  
  Pin 5 may be left unconnected unless
  an external shutdown feature is needed.
- 0603
- 0402 | 1210 | 0603
- 0603
- 0603
- +5V Step-Up DC/DC Converter

## Sheet 7 of 7: Test Circuits
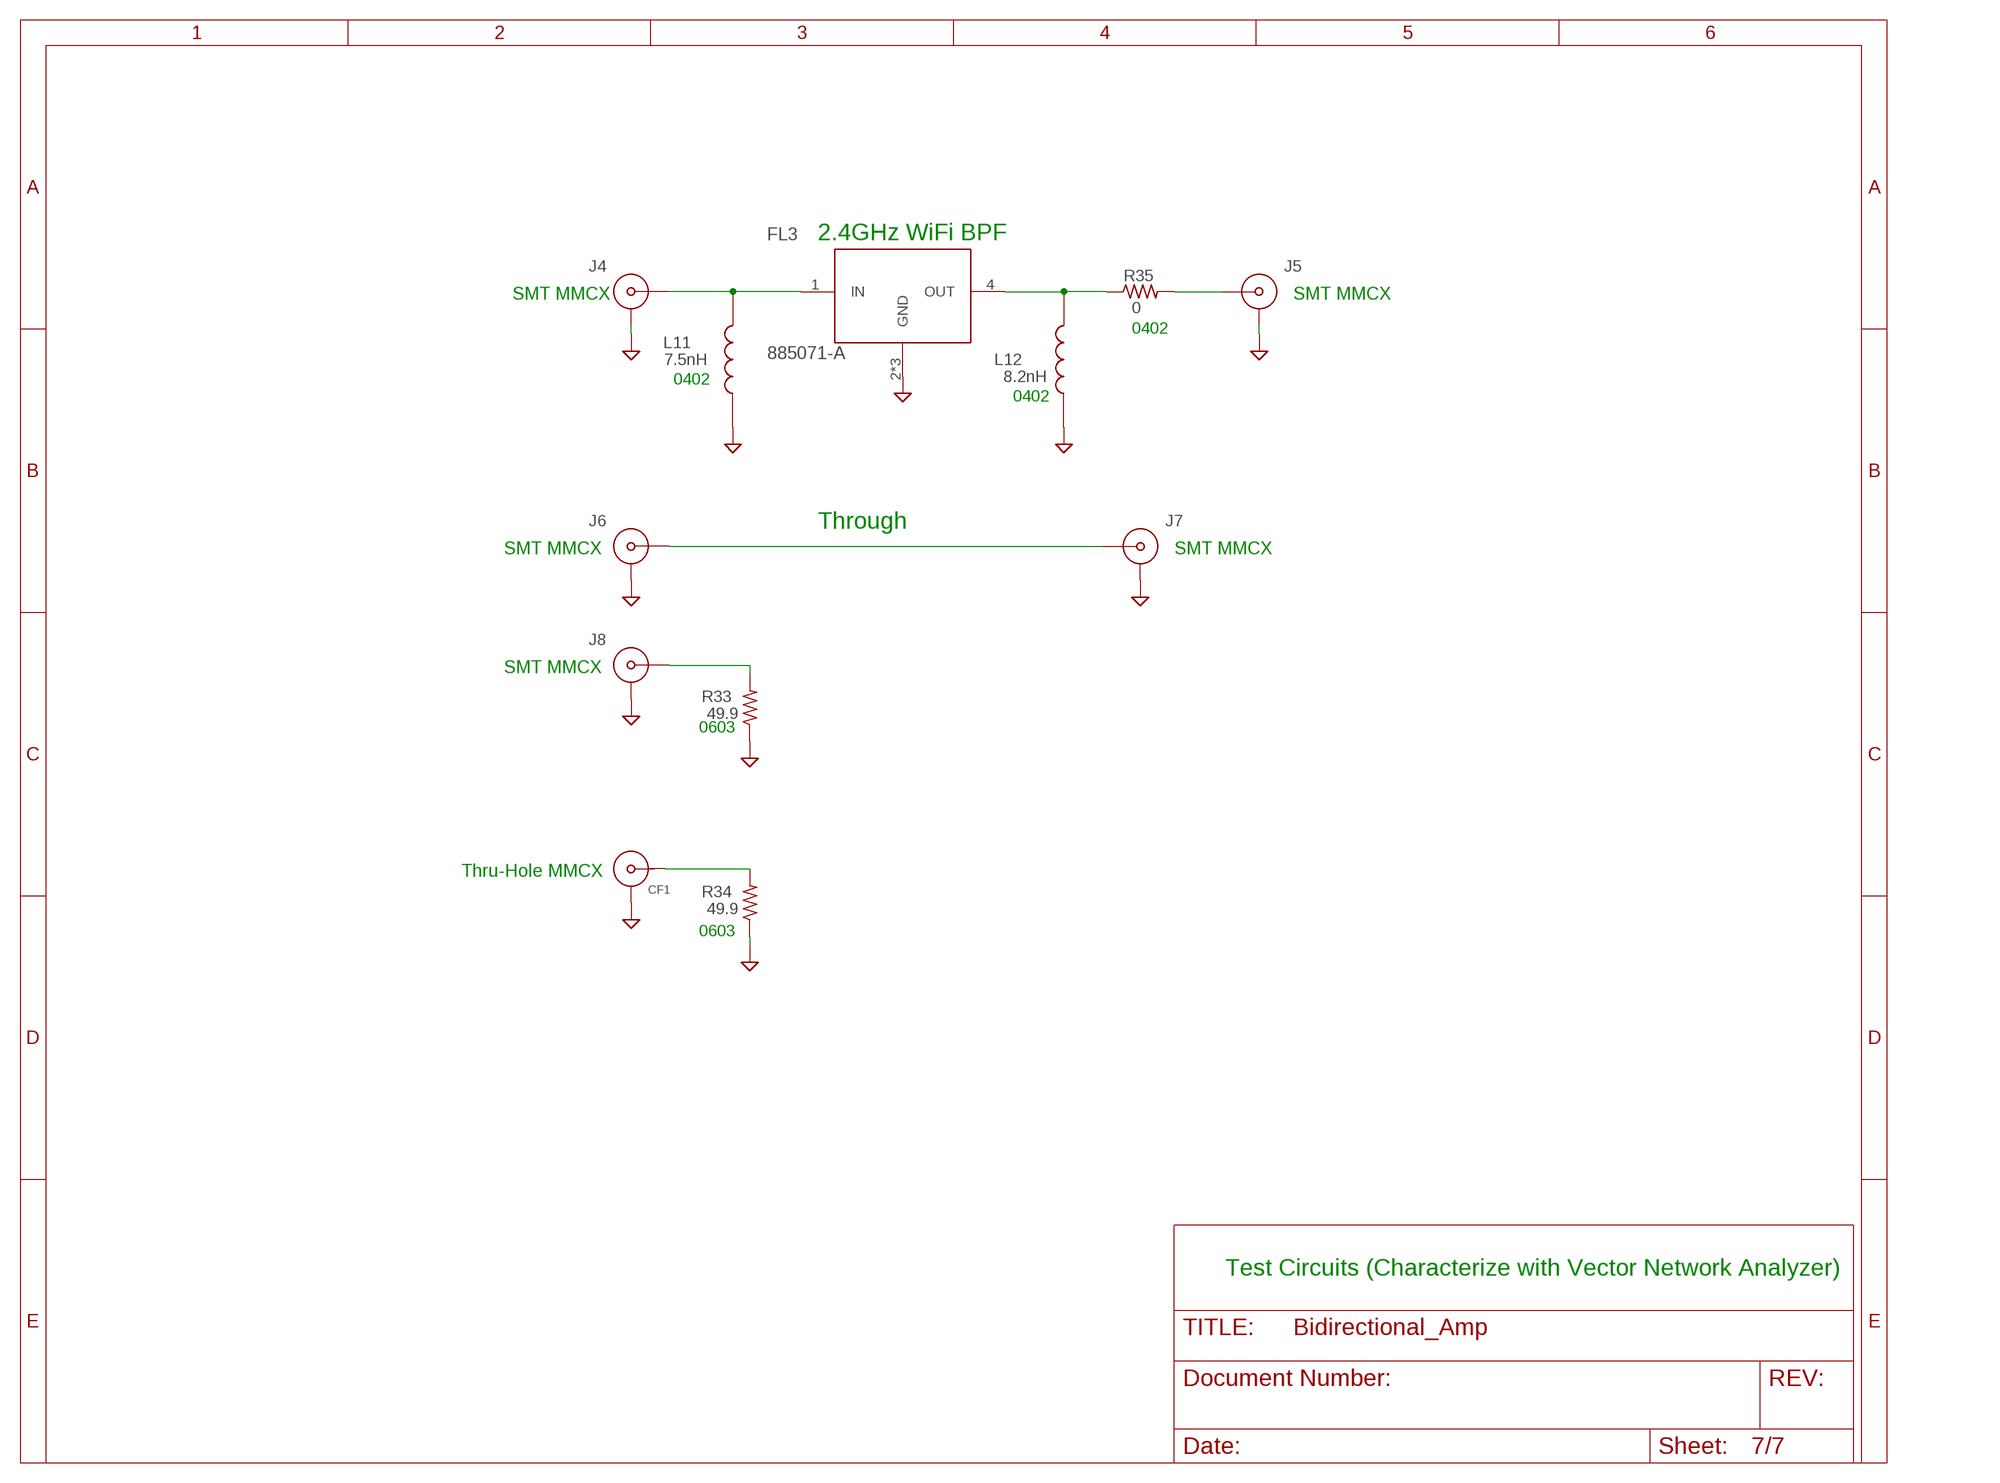
[diagram p6: schematic, sheet 7]

### Parts
CF1  CON-MMCX-F-MOLEX-0734151001  [CON-MMCX-F-MOLEX-0734151001]
FL3  885071-A  [FIL_B39162B9417K610]
J4  73415-2061  [73415-2063]
J5  73415-2061  [73415-2063]
J6  73415-2061  [73415-2063]
J7  73415-2061  [73415-2063]
J8  73415-2061  [73415-2063]
L11  7.5nH  0402CS-1N2XJLW  [0402CS1N2XJLW]
L12  8.2nH  0402CS-1N2XJLW  [0402CS1N2XJLW]
R33  49.9  R-US_R0603  [R0603]
R34  49.9  R-US_R0603  [R0603]
R35  0  R-US_0402-A  [.0402-A]

### Nets
GND: CF1.G1(SHIELD) CF1.G2(SHIELD) CF1.G3(SHIELD) CF1.G4(SHIELD) FL3.2(GND) FL3.3(GND) FL3.5(GND) J4.2(GND) J4.3(GND) J4.4(GND) J4.5(GND) J5.2(GND) J5.3(GND) J5.4(GND) J5.5(GND) J6.2(GND) J6.3(GND) J6.4(GND) J6.5(GND) J7.2(GND) J7.3(GND) J7.4(GND) J7.5(GND) J8.2(GND) J8.3(GND) J8.4(GND) J8.5(GND) L11.1 L12.1 R33.1 R34.1 ; also sheet 1,2,3,4,5,6
N$41 [RF]: FL3.4(OUT) L12.2 R35.1
N$46 [RF]: FL3.1(IN) J4.1(CTR) L11.2
N$47 [RF]: J6.1(CTR) J7.1(CTR)
N$48 [RF]: J8.1(CTR) R33.2
N$49 [RF]: CF1.CENTER R34.2
N$50 [RF]: J5.1(CTR) R35.2

### Notes on the sheet
- 2.4GHz WiFi BPF
- SMT MMCX | SMT MMCX
- 0402
- 0402
- 0402
- Through
- SMT MMCX | SMT MMCX
- SMT MMCX
- 0603
- Thru-Hole MMCX
- 0603
- Test Circuits (Characterize with Vector Network Analyzer)

## Library data of the parts
C1 C26-C28 = rcl:C-EU: CAPACITOR, European symbol; MPN: GJM1555C1H150JB01D; SPICEPREFIX: C
C2 = rcl:C-EU: CAPACITOR, European symbol; MPN: C1005X7R1C224K050BE; SPICEPREFIX: C
C3 C5 C7 C9 C11-C13 C30 C32 C33 = rcl:C-EU: CAPACITOR, European symbol; MPN: GCM1555C1H101JA16D; SPICEPREFIX: C
C4 C6 C8 C10 C14 C31 = rcl:C-EU: CAPACITOR, European symbol; MPN: CGA2B1X7R1C104K050BC; SPICEPREFIX: C
C15-C18 = rcl:C-EU: CAPACITOR, European symbol; MPN: C0603C104K5RACAUTO; SPICEPREFIX: C
C19 C37 = rcl:C-EU: CAPACITOR, European symbol; MPN: CGA3E2C0G1H102J080AA; SPICEPREFIX: C
C20 = rcl:C-EU: CAPACITOR, European symbol; MPN: GCM1885C1H101JA16D; SPICEPREFIX: C
C21 = rcl:C-EU: CAPACITOR, European symbol; MPN: UVK105CG030JW-F; SPICEPREFIX: C
C22 = rcl:C-EU: CAPACITOR, European symbol; MPN: UVK105CG2R2JW-F; SPICEPREFIX: C
C23 = rcl:C-EU: CAPACITOR, European symbol; MPN: GJM1555C1H1R6BB01D; SPICEPREFIX: C
C24 = rcl:C-EU: CAPACITOR, European symbol; MPN: 06032U4R7BAT2A; SPICEPREFIX: C
C25 C35 = rcl:C-EU: CAPACITOR, European symbol; MPN: GCJ32ER71C226KE01L; SPICEPREFIX: C
C29 = rcl:C-EU: CAPACITOR, European symbol; MPN: C0603X105M4RACAUTO; SPICEPREFIX: C
C34 = rcl:C-EU: CAPACITOR, European symbol; MPN: GCJ31CR71C475KA01L; SIZE: 1206; SPICEPREFIX: C; TEMP: X7R; VOLTAGE: 16V
C38 = rcl:C-EU: CAPACITOR, European symbol; MPN: GCM1555C1H220JA16J; SPICEPREFIX: C
CF1 = oresat-connectors:CON-MMCX-F-MOLEX-0734151001: MMCX, Female, Through Hole, Right angle. Modeled after Molex 0734151001.; MPN: 0734151001
D1 D2 = SparkFun-DiscreteSemi:DIODE-SCHOTTKY: Schottky diode A Schottky diode is a semiconductor diode which has a low forward voltage drop and a very fast switching action.; MPN: PMEG1020EJ,115; PROD_ID: DIO-10955; VALUE: 0.5A/40V/420mV
FL1-FL3 = U-Qorvo-885071_A-2.4GHz-BPF:885071-A: 2.4GHz BPF; MPN: 885071-A
J1 J2 J4-J8 = SamacSys_Parts:73415-2061: MMCX 50 Ohm SMT PCB mount vertical jack Molex 50 Straight PCB Mount MMCX Connector, jack, Solder Termination, DC to 6GHz, RG178 Source: Datasheet <https://componentsearchengine.com/Datasheets/2/73415-2061.pdf>; DESCRIPTION: MMCX 50 Ohm SMT PCB mount vertical jack Molex 50 Straight PCB Mount MMCX Connector, jack, Solder Termination, DC to 6GHz, RG178; MANUFACTURER_NAME: Molex; MPN: 0734152061
J3 = SamacSys_Parts:22-23-2051: Headers & Wire Housings VERT PCB HDR 5P TIN FRICTION LOCK Source: Datasheet <http://docs-europe.electrocomponents.com/webdocs/1363/0900766b8136318b.pdf>; DESCRIPTION: Headers & Wire Housings VERT PCB HDR 5P TIN FRICTION LOCK; HEIGHT: 8.18mm; MANUFACTURER_NAME: Molex; MANUFACTURER_PART_NUMBER: 22-23-2051
L1 = SamacSys_Parts:1008HQ-10NXJLB: Fixed Inductors 1008HQ 10 nH 5 % 1.6 A; DESCRIPTION: Fixed Inductors 1008CS AEC-Q200 150 nH 5 % 0.58 A; MANUFACTURER_NAME: COILCRAFT; MANUFACTURER_PART_NUMBER: 1008HQ-10NXJLB
L2 = SamacSys_Parts:0805CS-060XJLC: Fixed Inductors 0805CS Ceramic Chip 6.8 nH 5 % 0.6 A; DESCRIPTION: Fixed Inductors 0805CS Ceramic Chip 6.8 nH 5 % 0.6 A; HEIGHT: mm; MANUFACTURER_NAME: COILCRAFT; MANUFACTURER_PART_NUMBER: 0805CS-060XJLC
L3 = SamacSys_Parts:0402CS-1N2XJLW: RF inductor, ceramic core, 5% tol, SMT, RoHS, halogen-free Source: Datasheet <https://www.coilcraft.com/misc/0402csd.html>; DESCRIPTION: RF inductor, ceramic core, 5% tol, SMT, RoHS, halogen-free; HEIGHT: 0mm; MANUFACTURER_NAME: COILCRAFT; MANUFACTURER_PART_NUMBER: 0402CS-1N2XJLW
L4 = SamacSys_Parts:0603CS-68NXJLW: Fixed Inductors 0603CS High Q, 68nH 0.6A Source: Datasheet <https://www.coilcraft.com/pdfs/0603cs.pdf>; HEIGHT: 1mm; MANUFACTURER_NAME: COILCRAFT; MPN: 0603CS-68NXJLW
L5 L7 L11 = SamacSys_Parts:0402CS-1N2XJLW: RF inductor, ceramic core, 5% tol, SMT, RoHS, halogen-free Source: Datasheet <https://www.coilcraft.com/misc/0402csd.html>; DESCRIPTION: RF inductor, ceramic core, 5% tol, SMT, RoHS, halogen-free; HEIGHT: 0mm; MANUFACTURER_NAME: COILCRAFT; MANUFACTURER_PART_NUMBER: 0402CS-7N5XGLU; VALUE: 1.2nH
L6 L8 L12 = SamacSys_Parts:0402CS-1N2XJLW: RF inductor, ceramic core, 5% tol, SMT, RoHS, halogen-free Source: Datasheet <https://www.coilcraft.com/misc/0402csd.html>; DESCRIPTION: RF inductor, ceramic core, 5% tol, SMT, RoHS, halogen-free; HEIGHT: 0mm; MANUFACTURER_NAME: COILCRAFT; MANUFACTURER_PART_NUMBER: 0402CS-8N2XGLU; VALUE: 1.2nH
L9 L10 = SamacSys_Parts:XFL4020-222MEB: Fixed Inductors 2.2uH 20% 8A 23.5mOhms AEC-Q200 Source: Datasheet <https://www.coilcraft.com/pdfs/xfl4020.pdf>; DESCRIPTION: Fixed Inductors 2.2uH 20% 8A 23.5mOhms AEC-Q200; MANUFACTURER_NAME: COILCRAFT; MANUFACTURER_PART_NUMBER: XFL4020-222MEB
LED1 = SamacSys_Parts:VLMK3102-GS08: VISHAY - VLMK3102-GS08. - LED, RED, 630NM, PLCC-2; DESCRIPTION: VISHAY - VLMK3102-GS08 - LED, RED PLCC-2; HEIGHT: mm; MANUFACTURER_NAME: Vishay; MANUFACTURER_PART_NUMBER: VLMK3102-GS08
PD1 = SamacSys_Parts:PD2328J5050S2HF: Ultra Low Profile 0805 Power Divider Source: Datasheet <https://www.anaren.com/sites/default/files/PD2328J5050S2HF_DataSheet_RevA.pdf>; DESCRIPTION: Ultra Low Profile 0805 Power Divider; HEIGHT: mm; MANUFACTURER_NAME: ANAREN; MANUFACTURER_PART_NUMBER: PD2328J5050S2HF
R1 R2 = rcl:R-US_: RESISTOR, American symbol; MPN: ERJ-3EKF1470V; SPICEPREFIX: R
R3 = rcl:R-US_: RESISTOR, American symbol; MPN: ERJ-3EKF17R8V; SPICEPREFIX: R
R4 = rcl:R-US_: RESISTOR, American symbol; MPN: ERJ-3EKF2940V; SPICEPREFIX: R
R5 R6 R8 = rcl:R-US_: RESISTOR, American symbol; SPICEPREFIX: R
R7 R23 = rcl:R-US_: RESISTOR, American symbol; MPN: ERJ-3GEY0R00V; SPICEPREFIX: R
R9 R21 = rcl:R-US_: RESISTOR, American symbol; MPN: ERJ-3EKF1002V; SPICEPREFIX: R
R10 = rcl:R-US_: RESISTOR, American symbol; MPN: ERJ-3EKF1911V; SPICEPREFIX: R
R11 R12 = rcl:R-US_: RESISTOR, American symbol; MPN: CRCW0603499KFKEB; SPICEPREFIX: R
R13 R15 R24 R26 R30 = rcl_custom:R-US_: RESISTOR, American symbol; MPN: ERJ-3EKF1002V
R14 R16 R25 R27 = rcl_custom:R-US_: RESISTOR, American symbol; MPN: ERJ-3EKF5621V
R17 = rcl:R-US_: RESISTOR, American symbol; MPN: ERJ-6GEY0R00V; SPICEPREFIX: R
R18 = rcl:R-US_: RESISTOR, American symbol; MPN: ERJ-2GEJ1R2X; SPICEPREFIX: R
R19 = rcl:R-US_: RESISTOR, American symbol; MPN: ERJ-3EKF1100V; SPICEPREFIX: R
R20 = rcl:R-US_: RESISTOR, American symbol; MPN: ERJ-3EKF2200V; SPICEPREFIX: R
R22 = rcl:R-US_: RESISTOR, American symbol; MPN: ERJ-3GEYJ333V; SPICEPREFIX: R
R28 = rcl_custom:R-US_: RESISTOR, American symbol; MPN: ERJ-3EKF3833V
R29 = rcl_custom:R-US_: RESISTOR, American symbol; MPN: ERJ-3EKF1213V
R31 = rcl_custom:R-US_: RESISTOR, American symbol; MPN: ERJ-3GEYJ103V
R32 = rcl:R-US_: RESISTOR, American symbol; MPN: ESR03EZPJ331; SPICEPREFIX: R
R33 R34 = rcl:R-US_: RESISTOR, American symbol; MPN: ERJ-3EKF49R9V; SPICEPREFIX: R
R35 = oresat-rcl:R-US_: RESISTOR, American symbol; MPN: ERJ-2GE0R00X
S1 = T211SY9CKE:T201MH9V3BE: Toggle Switches ON ON ON SPDT Source: Datasheet <https://www.ckswitches.com/media/1391/ttoggle.pdf>; ARROW_PART_NUMBER: T211SY9CQE; ARROW_PRICE/STOCK: https://www.arrow.com/en/products/t201mh9v3be/ck; DESCRIPTION: Toggle Switches ON None ON DPDT 20VAC 20VDC 0.4W; HEIGHT: 20mm; MANUFACTURER_NAME: C & K COMPONENTS; MANUFACTURER_PART_NUMBER: T211SY9CQE; VALUE: T211SY9CKE
U1 = LTC5536ES6:LTC5536ES6TRMPBF; MANUFACTURER_PART_NUMBER: LTC5536; VENDOR: Linear Technology
U2 U3 = LTC6994CS6-1_UL:LTC6994CS6-1PBF; MANUFACTURER_PART_NUMBER: LTC6994-1; VENDOR: Linear Technology
U4 = U-Qorvo-QPC1022-RF-SPDT-switch:QPC1022; MPN: QPC1022SR
U5 = SamacSys_Parts:NC7S04M5XX: Inverter 1-Element CMOS 5-Pin SOT-23 Fairchild Semiconductor NC7S04M5X CMOS Inverter, 2 6 V, 5-Pin SOT-23 Source: Datasheet <https://docs-emea.rs-online.com/webdocs/0d1d/0900766b80d1df2f.pdf>; ARROW_PART_NUMBER: NC7S04M5XX; ARROW_PRICE/STOCK: http://uk.rs-online.com/web/p/products/6709769; DESCRIPTION: Inverter 1-Element CMOS 5-Pin SOT-23 Fairchild Semiconductor NC7S04M5X CMOS Inverter, 2 6 V, 5-Pin SOT-23; HEIGHT: 1.4mm; MANUFACTURER_NAME: Fairchild Semiconductor; MANUFACTURER_PART_NUMBER: NC7S04M5X; RS_PART_NUMBER: 6709769; RS_PRICE/STOCK: http://uk.rs-online.com/web/p/products/6709769
U6 = SamacSys_Parts:TQP9111: RF Amplifier 1.8-2.7GHz Gn 29.8dB P1dB 32.5dBm 2 stage Source: Datasheet <https://componentsearchengine.com/Datasheets/1/TQP9111.pdf>; ARROW_PART_NUMBER: TQP9111; DESCRIPTION: RF Amplifier 1.8-2.7GHz Gn 29.8dB P1dB 32.5dBm 2 stage; HEIGHT: 1.02mm; MANUFACTURER_NAME: Qorvo; MANUFACTURER_PART_NUMBER: TQP9111
U7 = TQP3M9035:TQP3M9035; MPN: TQP3M9035
U8 = U-Qorvo-QPC1022-RF-SPDT-switch:QPC1022
U9 = LTC3428:LTC3428EDDPBF; MANUFACTURER_PART_NUMBER: LTC3428EDD#PBF; VENDOR: Linear Technology

## Net classes
1 RF: width 0.33 mm, clearance 0.34 mm